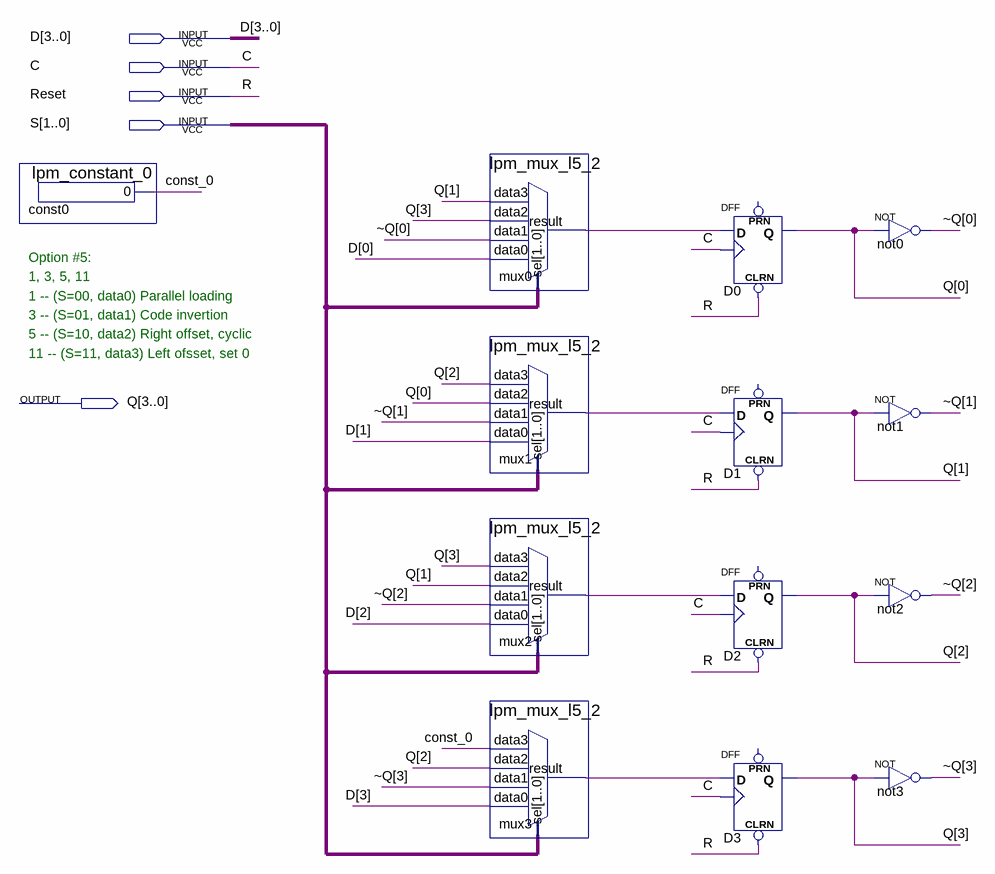
[diagram p0: schematic sheet]
// Quartus schematic Laboratory_work_5_2_project.bdf as structural Verilog: 13 symbols, 5 pins
module Laboratory_work_5_2_project (
  input  [3:0] D,
  input  C,
  input  Reset,
  input  [1:0] S,
  output [3:0] Q
);

  wire const_0, mux0_result, mux1_result, mux2_result, mux3_result;
  wire [3:0] \~Q ;

  lpm_constant_0 const0 (.result(const_0));
  lpm_mux_l5_2 mux0 (.data3(Q[1]), .data2(Q[3]), .data1(\~Q [0]), .data0(D[0]), .sel(S), .result(mux0_result));
  lpm_mux_l5_2 mux1 (.data3(Q[2]), .data2(Q[0]), .data1(\~Q [1]), .data0(D[1]), .sel(S), .result(mux1_result));
  lpm_mux_l5_2 mux2 (.data3(Q[3]), .data2(Q[1]), .data1(\~Q [2]), .data0(D[2]), .sel(S), .result(mux2_result));
  lpm_mux_l5_2 mux3 (.data3(const_0), .data2(Q[2]), .data1(\~Q [3]), .data0(D[3]), .sel(S), .result(mux3_result));
  DFF D0 (.CLRN(Reset), .CLK(C), .D(mux0_result), .Q(Q[0]));  // open: PRN
  DFF D1 (.CLRN(Reset), .CLK(C), .D(mux1_result), .Q(Q[1]));  // open: PRN
  DFF D2 (.CLRN(Reset), .CLK(C), .D(mux2_result), .Q(Q[2]));  // open: PRN
  DFF D3 (.CLRN(Reset), .CLK(C), .D(mux3_result), .Q(Q[3]));  // open: PRN
  not not0 (\~Q [0], Q[0]);
  not not1 (\~Q [1], Q[1]);
  not not2 (\~Q [2], Q[2]);
  not not3 (\~Q [3], Q[3]);

  // Other names for the same wires on the sheet: R = Reset

  // Notes on the sheet:
  //   Option #5:
  //   1, 3, 5, 11
  //   1 -- (S=00, data0) Parallel loading
  //   3 -- (S=01, data1) Code invertion
  //   5 -- (S=10, data2) Right offset, cyclic
  //   11 -- (S=11, data3) Left ofsset, set 0
endmodule
